# EAGLE design V2 (EAGLE 9.6.2)
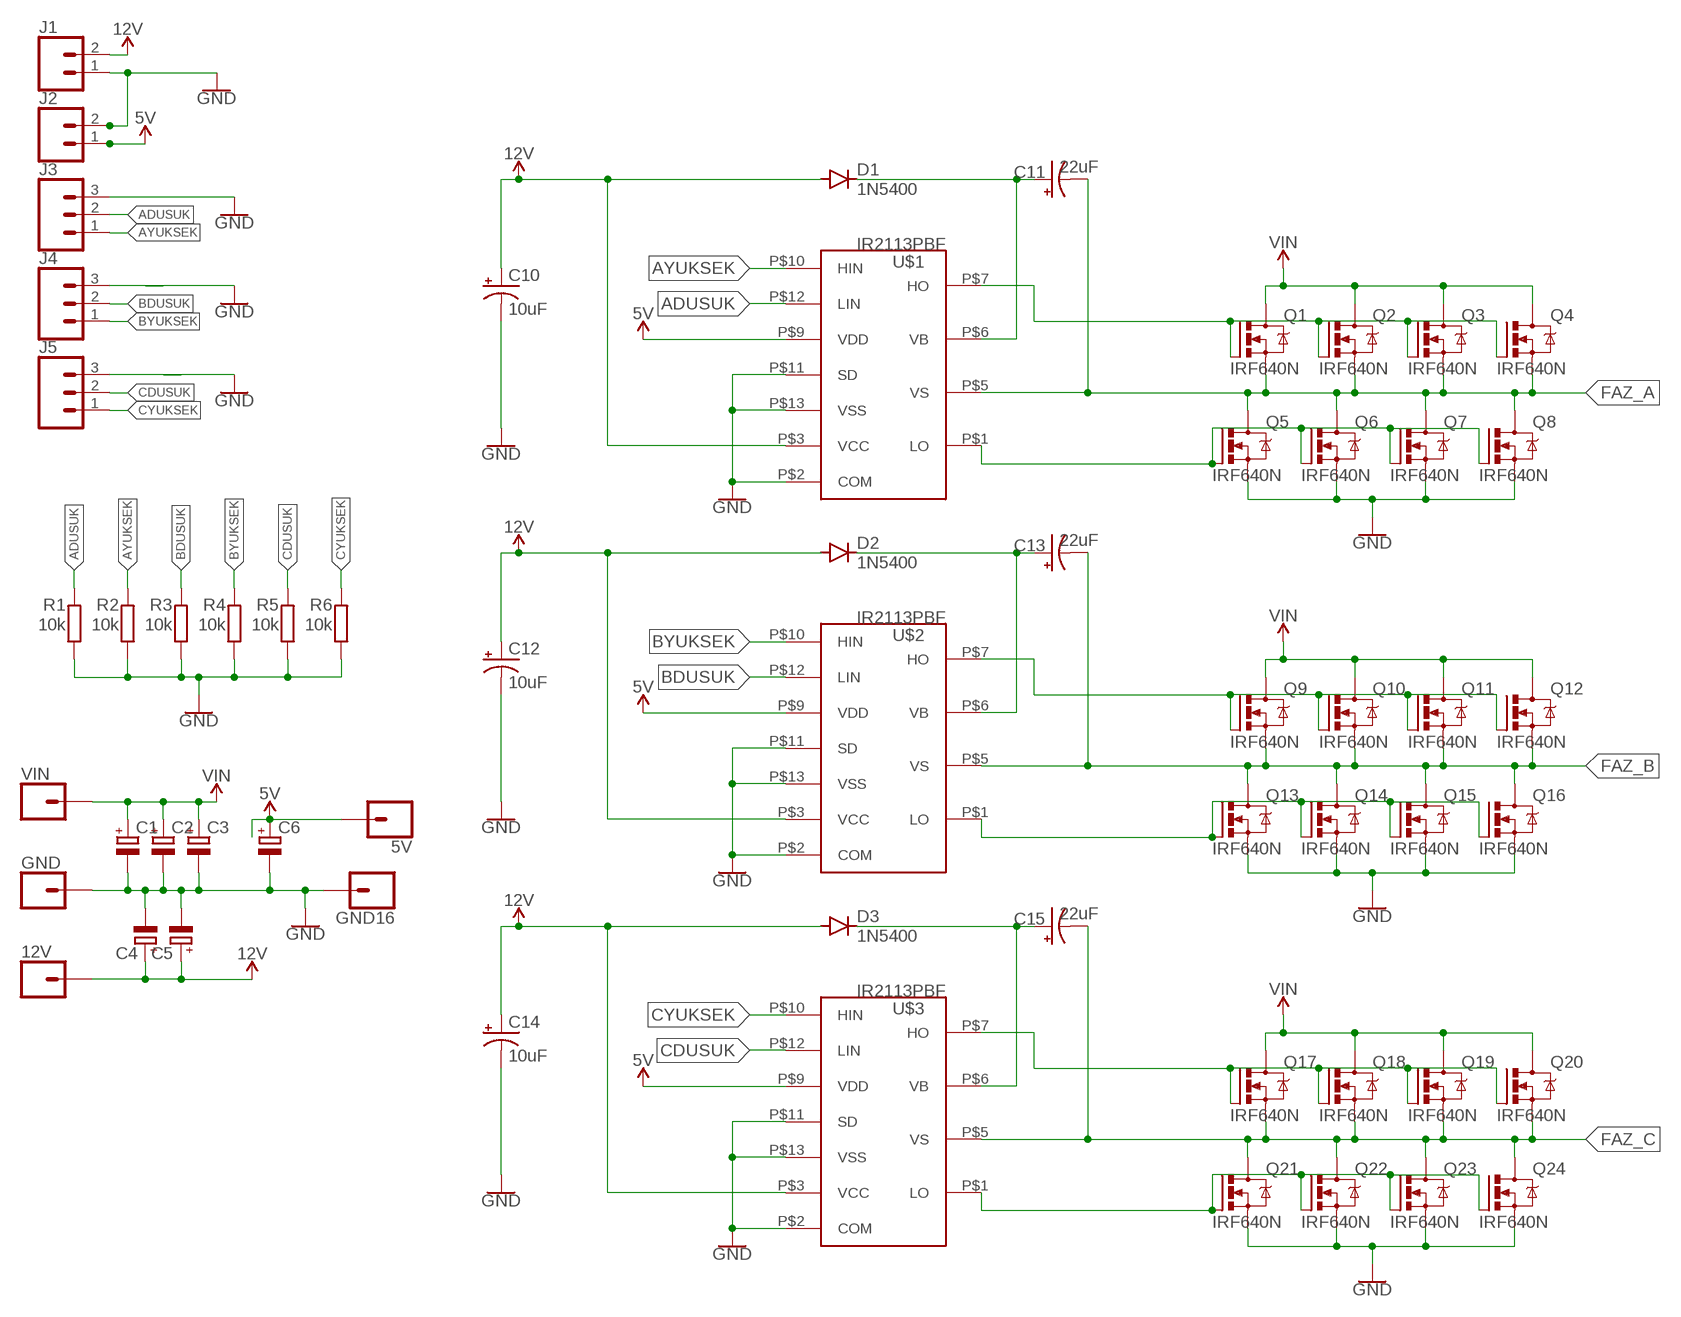
[diagram p0: schematic, sheet 1]

## Parts
5V  CONN_01SNAP-MALE  [SNAP-MALE]
12V  CONN_01SNAP-MALE  [SNAP-MALE]
C1  16MM-DIA-CAPASITOR  [16MM-DIA-CAPASITOR]
C2  16MM-DIA-CAPASITOR  [16MM-DIA-CAPASITOR]
C3  16MM-DIA-CAPASITOR  [16MM-DIA-CAPASITOR]
C4  16MM-DIA-CAPASITOR  [16MM-DIA-CAPASITOR]
C5  16MM-DIA-CAPASITOR  [16MM-DIA-CAPASITOR]
C6  C-POL_RADIAL-25MM-DIA  [CAPPRD550W110D1250H2500B]
C10  10uF  10UF-POLAR-RADIAL-2.5MM-25V-20%  [CPOL-RADIAL-2.5MM-5MM]
C11  22uF  10UF-POLAR-RADIAL-2.5MM-25V-20%  [CPOL-RADIAL-2.5MM-5MM]
C12  10uF  10UF-POLAR-RADIAL-2.5MM-25V-20%  [CPOL-RADIAL-2.5MM-5MM]
C13  22uF  10UF-POLAR-RADIAL-2.5MM-25V-20%  [CPOL-RADIAL-2.5MM-5MM]
C14  10uF  10UF-POLAR-RADIAL-2.5MM-25V-20%  [CPOL-RADIAL-2.5MM-5MM]
C15  22uF  10UF-POLAR-RADIAL-2.5MM-25V-20%  [CPOL-RADIAL-2.5MM-5MM]
D1  1N5400  [DO201-15]
D2  1N5400  [DO201-15]
D3  1N5400  [DO201-15]
GND  CONN_01SNAP-MALE  [SNAP-MALE]
GND16  CONN_01SNAP-MALE  [SNAP-MALE]
J1  CONN_025MM  [SCREWTERMINAL-5MM-2]
J2  CONN_025MM  [SCREWTERMINAL-5MM-2]
J3  CONN_03-SCREW-5MM  [SCREWTERMINAL-5MM-3]
J4  CONN_03-SCREW-5MM  [SCREWTERMINAL-5MM-3]
J5  CONN_03-SCREW-5MM  [SCREWTERMINAL-5MM-3]
Q1  IRF640N  [TO-220-PAD]
Q2  IRF640N  [TO-220-PAD]
Q3  IRF640N  [TO-220-PAD]
Q4  IRF640N  [TO-220-PAD]
Q5  IRF640N  [TO-220-PAD]
Q6  IRF640N  [TO-220-PAD]
Q7  IRF640N  [TO-220-PAD]
Q8  IRF640N  [TO-220-PAD]
Q9  IRF640N  [TO-220-PAD]
Q10  IRF640N  [TO-220-PAD]
Q11  IRF640N  [TO-220-PAD]
Q12  IRF640N  [TO-220-PAD]
Q13  IRF640N  [TO-220-PAD]
Q14  IRF640N  [TO-220-PAD]
Q15  IRF640N  [TO-220-PAD]
Q16  IRF640N  [TO-220-PAD]
Q17  IRF640N  [TO-220-PAD]
Q18  IRF640N  [TO-220-PAD]
Q19  IRF640N  [TO-220-PAD]
Q20  IRF640N  [TO-220-PAD]
Q21  IRF640N  [TO-220-PAD]
Q22  IRF640N  [TO-220-PAD]
Q23  IRF640N  [TO-220-PAD]
Q24  IRF640N  [TO-220-PAD]
R1  10k  R-EU_0207/10  [0207/10]
R2  10k  R-EU_0207/10  [0207/10]
R3  10k  R-EU_0207/10  [0207/10]
R4  10k  R-EU_0207/10  [0207/10]
R5  10k  R-EU_0207/10  [0207/10]
R6  10k  R-EU_0207/10  [0207/10]
U$1  IR2113PBF  [PDIP-14]
U$2  IR2113PBF  [PDIP-14]
U$3  IR2113PBF  [PDIP-14]
VIN  CONN_01SNAP-MALE  [SNAP-MALE]

## Nets
5V: 5V.2 C6.1(+) J2.1 U$1.P$9(VDD) U$2.P$9(VDD) U$3.P$9(VDD)
12V: 12V.2 C4.+ C5.+ C10.1(+) C12.1(+) C14.1(+) D1.A D2.A D3.A J1.2 U$1.P$3(VCC) U$2.P$3(VCC) U$3.P$3(VCC)
ADUSUK: J3.2 R1.2 U$1.P$12(LIN)
AYUKSEK: J3.1 R2.2 U$1.P$10(HIN)
BDUSUK: J4.2 R3.2 U$2.P$12(LIN)
BYUKSEK: J4.1 R4.2 U$2.P$10(HIN)
CDUSUK: J5.2 R5.2 U$3.P$12(LIN)
CYUKSEK: J5.1 R6.2 U$3.P$10(HIN)
FAZ_A: C11.2(-) Q1.3(S) Q2.3(S) Q3.3(S) Q4.3(S) Q5.TAB(D) Q6.TAB(D) Q7.TAB(D) Q8.TAB(D) U$1.P$5(VS)
FAZ_A_H: Q1.1(G) Q2.1(G) Q3.1(G) Q4.1(G) U$1.P$7(HO)
FAZ_A_L: Q5.1(G) Q6.1(G) Q7.1(G) Q8.1(G) U$1.P$1(LO)
FAZ_B: C13.2(-) Q9.3(S) Q10.3(S) Q11.3(S) Q12.3(S) Q13.TAB(D) Q14.TAB(D) Q15.TAB(D) Q16.TAB(D) U$2.P$5(VS)
FAZ_B_H: Q9.1(G) Q10.1(G) Q11.1(G) Q12.1(G) U$2.P$7(HO)
FAZ_B_L: Q13.1(G) Q14.1(G) Q15.1(G) Q16.1(G) U$2.P$1(LO)
FAZ_C: C15.2(-) Q17.3(S) Q18.3(S) Q19.3(S) Q20.3(S) Q21.TAB(D) Q22.TAB(D) Q23.TAB(D) Q24.TAB(D) U$3.P$5(VS)
FAZ_C_H: Q17.1(G) Q18.1(G) Q19.1(G) Q20.1(G) U$3.P$7(HO)
GND: C1.- C2.- C3.- C4.- C5.- C6.2(-) C10.2(-) C12.2(-) C14.2(-) GND16.2 GND.2 J1.1 J2.2 J3.3 J4.3 J5.3 Q5.3(S) Q6.3(S) Q7.3(S) Q8.3(S) Q13.3(S) Q14.3(S) Q15.3(S) Q16.3(S) Q21.3(S) Q22.3(S) Q23.3(S) Q24.3(S) R1.1 R2.1 R3.1 R4.1 R5.1 R6.1 U$1.P$2(COM) U$1.P$11(SD) U$1.P$13(VSS) U$2.P$2(COM) U$2.P$11(SD) U$2.P$13(VSS) U$3.P$2(COM) U$3.P$11(SD) U$3.P$13(VSS)
N$1: C13.1(+) D2.C U$2.P$6(VB)
N$2: C11.1(+) D1.C U$1.P$6(VB)
N$3: C15.1(+) D3.C U$3.P$6(VB)
N$7: Q21.1(G) Q22.1(G) Q23.1(G) Q24.1(G) U$3.P$1(LO)
VIN: C1.+ C2.+ C3.+ Q1.TAB(D) Q2.TAB(D) Q3.TAB(D) Q4.TAB(D) Q9.TAB(D) Q10.TAB(D) Q11.TAB(D) Q12.TAB(D) Q17.TAB(D) Q18.TAB(D) Q19.TAB(D) Q20.TAB(D) VIN.2

## Library data of the parts
5V 12V GND GND16 VIN = SparkFun-Connectors:CONN_01: Single connection point. Often used as Generic Header-pin footprint for 0.1 inch spaced/style header connections On any of the 0.1 inch spaced packages, you can populate with these: Break Away Headers - Straight <https://www.sparkfun.com/products/116> (PRT-00116) Break Away Male Headers - Right Angle <https://www.sparkfun.com/products/553> (PRT-00553) Female Headers <https://www.sparkfun.com/products/115> (PRT-00115) Break Away Headers - Machine Pin <https://www.sparkfun.com/products/117> (PRT-00117) Break Away Female Headers - Swiss Machine Pin <https://www.sparkfun.com/products/743> (PRT-00743) This device is also useful as a general connection point to wire up your design to another part of your project. Our various solder wires solder well into these plated through hole pads. Hook-Up Wire - Assortment (Stranded, 22 AWG) <https://www.sparkfun.com/products/11375> (PRT-11375) Hook-Up Wire - Assortment (Solid Core, 22 AWG) <https://www.sparkfun.com/products/11367> (PRT-11367) View the entire wire category on our website here <https://www.sparkfun.com/categories/141> Special notes: SMTSO-256-ET is a "flush mount" nut for a 4-40 screw. We mostly use this on specialty testbeds; it is a nice way to connect hardware to your PCB at an adjustable hieght. Also note, the SNAP packages are for using a snappable style connector. We sell a baggie of snaps and they are also used on two LilyPad designs: Snap Assortment - 30 pack (male and female) <https://www.sparkfun.com/products/11347> (DEV-11347) LilyPad Arduino SimpleSnap <https://www.sparkfun.com/products/10941> (DEV-10941) LilyPad SimpleSnap Protoboard <https://www.sparkfun.com/products/10940> (DEV-10940)
C1-C5 = El_yapimi:16MM-DIA-CAPASITOR
C6 = Capacitor:C-POL: Capacitor Polarised - Generic; CATEGORY: Capacitor
C10 C12 C14 = SparkFun-Capacitors:10UF-POLAR: 10.0µF polarized capacitors A capacitor is a passive two-terminal electrical component used to store electrical energy temporarily in an electric field.; PROD_ID: CAP-08440
C11 C13 C15 = SparkFun-Capacitors:10UF-POLAR: 10.0µF polarized capacitors A capacitor is a passive two-terminal electrical component used to store electrical energy temporarily in an electric field.; PROD_ID: CAP-08440; VALUE: 10uF
D1-D3 = diode:1N5400: DIODE standard rectifier, 3 A, 50 V (Motorola)
J1 J2 = SparkFun-Connectors:CONN_02: Multi connection point. Often used as Generic Header-pin footprint for 0.1 inch spaced/style header connections On any of the 0.1 inch spaced packages, you can populate with these: Break Away Headers - Straight <https://www.sparkfun.com/products/116> (PRT-00116) Break Away Male Headers - Right Angle <https://www.sparkfun.com/products/553> (PRT-00553) Female Headers <https://www.sparkfun.com/products/115> (PRT-00115) Break Away Headers - Machine Pin <https://www.sparkfun.com/products/117> (PRT-00117) Break Away Female Headers - Swiss Machine Pin <https://www.sparkfun.com/products/743> (PRT-00743) For SCREWTERMINALS and SPRING TERMINALS visit here: Screw Terimnals on SparkFun.com <https://www.sparkfun.com/search/results?term=Screw+Terminals> (5mm/3.5mm/2.54mm spacing) This device is also useful as a general connection point to wire up your design to another part of your project. Our various solder wires solder well into these plated through hole pads. Hook-Up Wire - Assortment (Stranded, 22 AWG) <https://www.sparkfun.com/products/11375> (PRT-11375) Hook-Up Wire - Assortment (Solid Core, 22 AWG) <https://www.sparkfun.com/products/11367> (PRT-11367) View the entire wire category on our website here <https://www.sparkfun.com/categories/141> Special notes: Molex polarized connector foot print use with: PRT-08233 with associated crimp pins and housings. 2.54_SCREWTERM for use with PRT-10571. 3.5mm Screw Terminal footprints for PRT-08084 5mm Screw Terminal footprints for use with PRT-08432; SF_SKU: PRT-08432
J3-J5 = SparkFun-Connectors:CONN_03: Multi connection point. Often used as Generic Header-pin footprint for 0.1 inch spaced/style header connections On any of the 0.1 inch spaced packages, you can populate with these: Break Away Headers - Straight <https://www.sparkfun.com/products/116> (PRT-00116) Break Away Male Headers - Right Angle <https://www.sparkfun.com/products/553> (PRT-00553) Female Headers <https://www.sparkfun.com/products/115> (PRT-00115) Break Away Headers - Machine Pin <https://www.sparkfun.com/products/117> (PRT-00117) Break Away Female Headers - Swiss Machine Pin <https://www.sparkfun.com/products/743> (PRT-00743) Stackable Header - 3 Pin (Female, 0.1") <https://www.sparkfun.com/products/13875> (PRT-13875) For SCREWTERMINALS and SPRING TERMINALS visit here: Screw Terimnals on SparkFun.com <https://www.sparkfun.com/search/results?term=Screw+Terminals> (5mm/3.5mm/2.54mm spacing) This device is also useful as a general connection point to wire up your design to another part of your project. Our various solder wires solder well into these plated through hole pads. Hook-Up Wire - Assortment (Stranded, 22 AWG) <https://www.sparkfun.com/products/11375> (PRT-11375) Hook-Up Wire - Assortment (Solid Core, 22 AWG) <https://www.sparkfun.com/products/11367> (PRT-11367) View the entire wire category on our website here <https://www.sparkfun.com/categories/141> Special notes: Molex polarized connector foot print use with SKU : PRT-08232 with associated crimp pins and housings.; PROD_ID: CONN-10134; SF_SKU: PRT-08433
Q1-Q24 = El_yapimi:IRF640N
R1-R6 = resistor:R-EU_: RESISTOR, European symbol
U$1-U$3 = El_yapimi:IR2113PBF

## Board
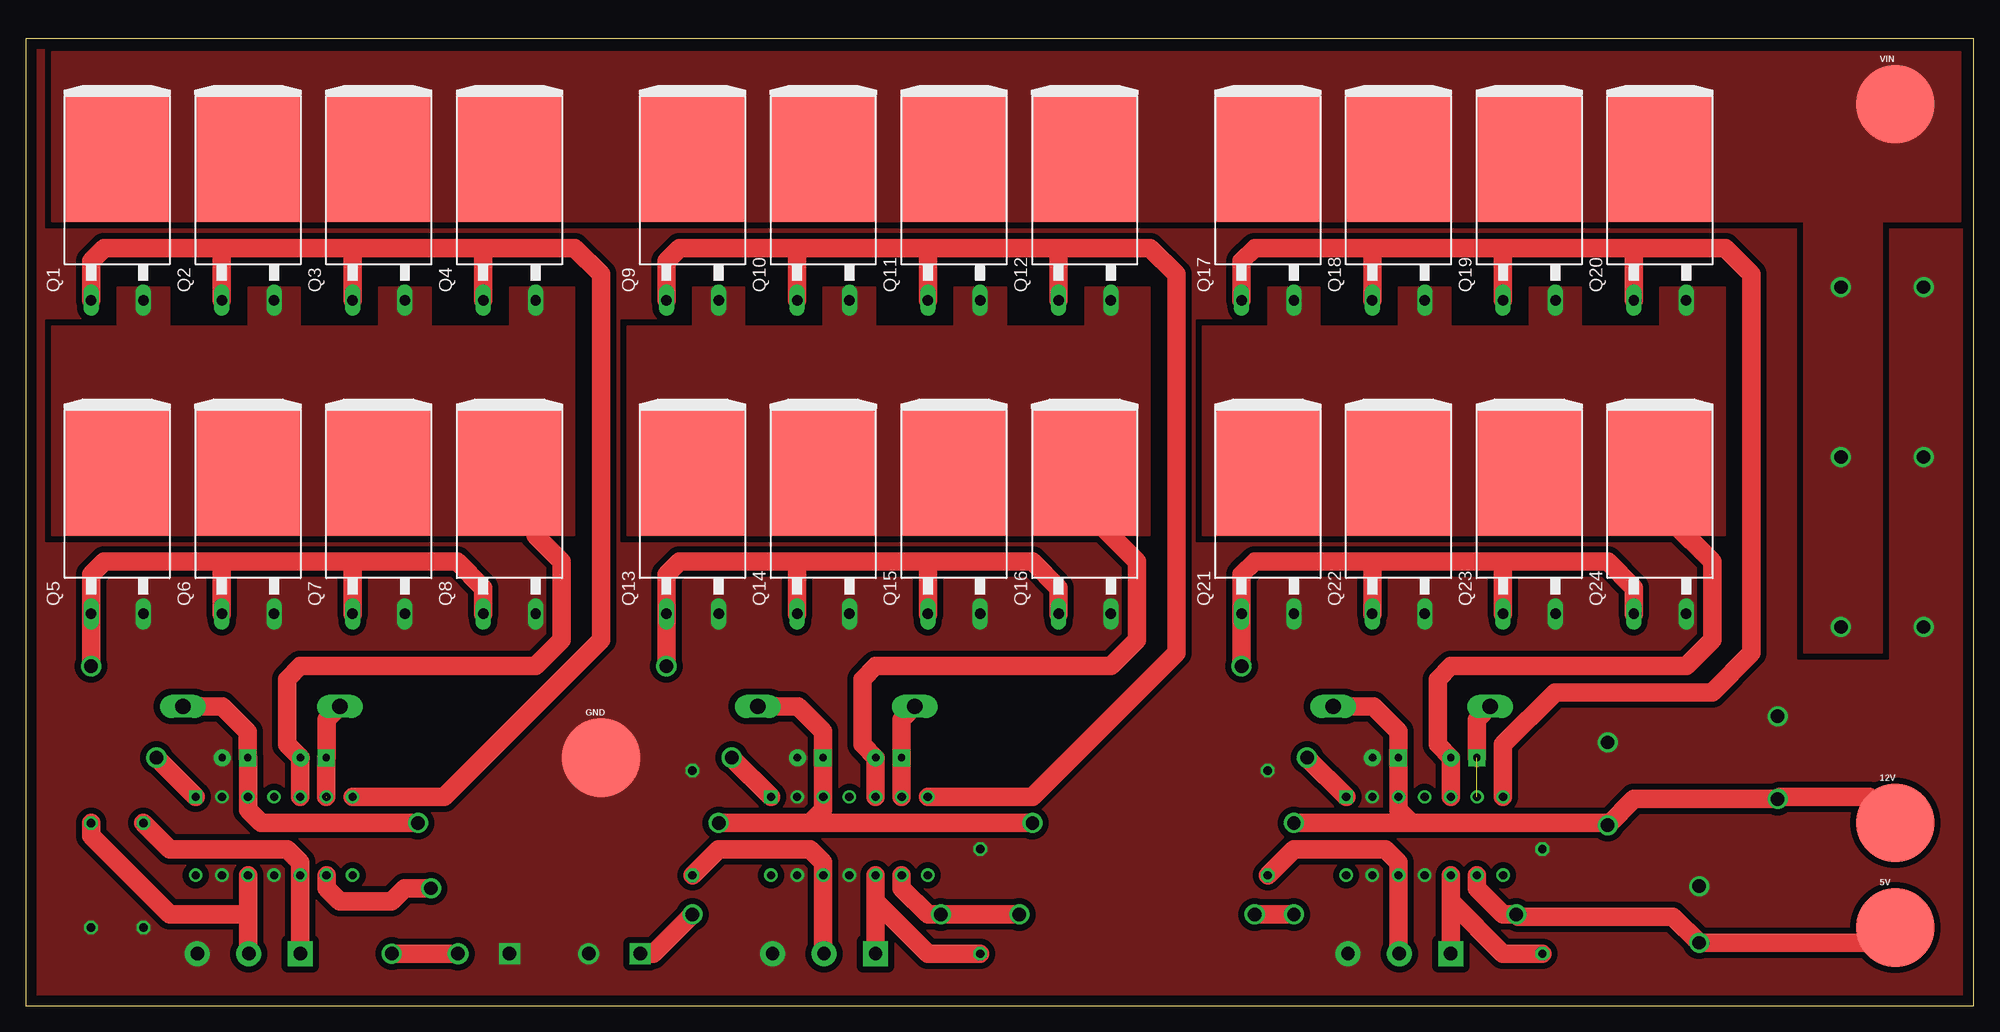
[diagram p1: board, top side]
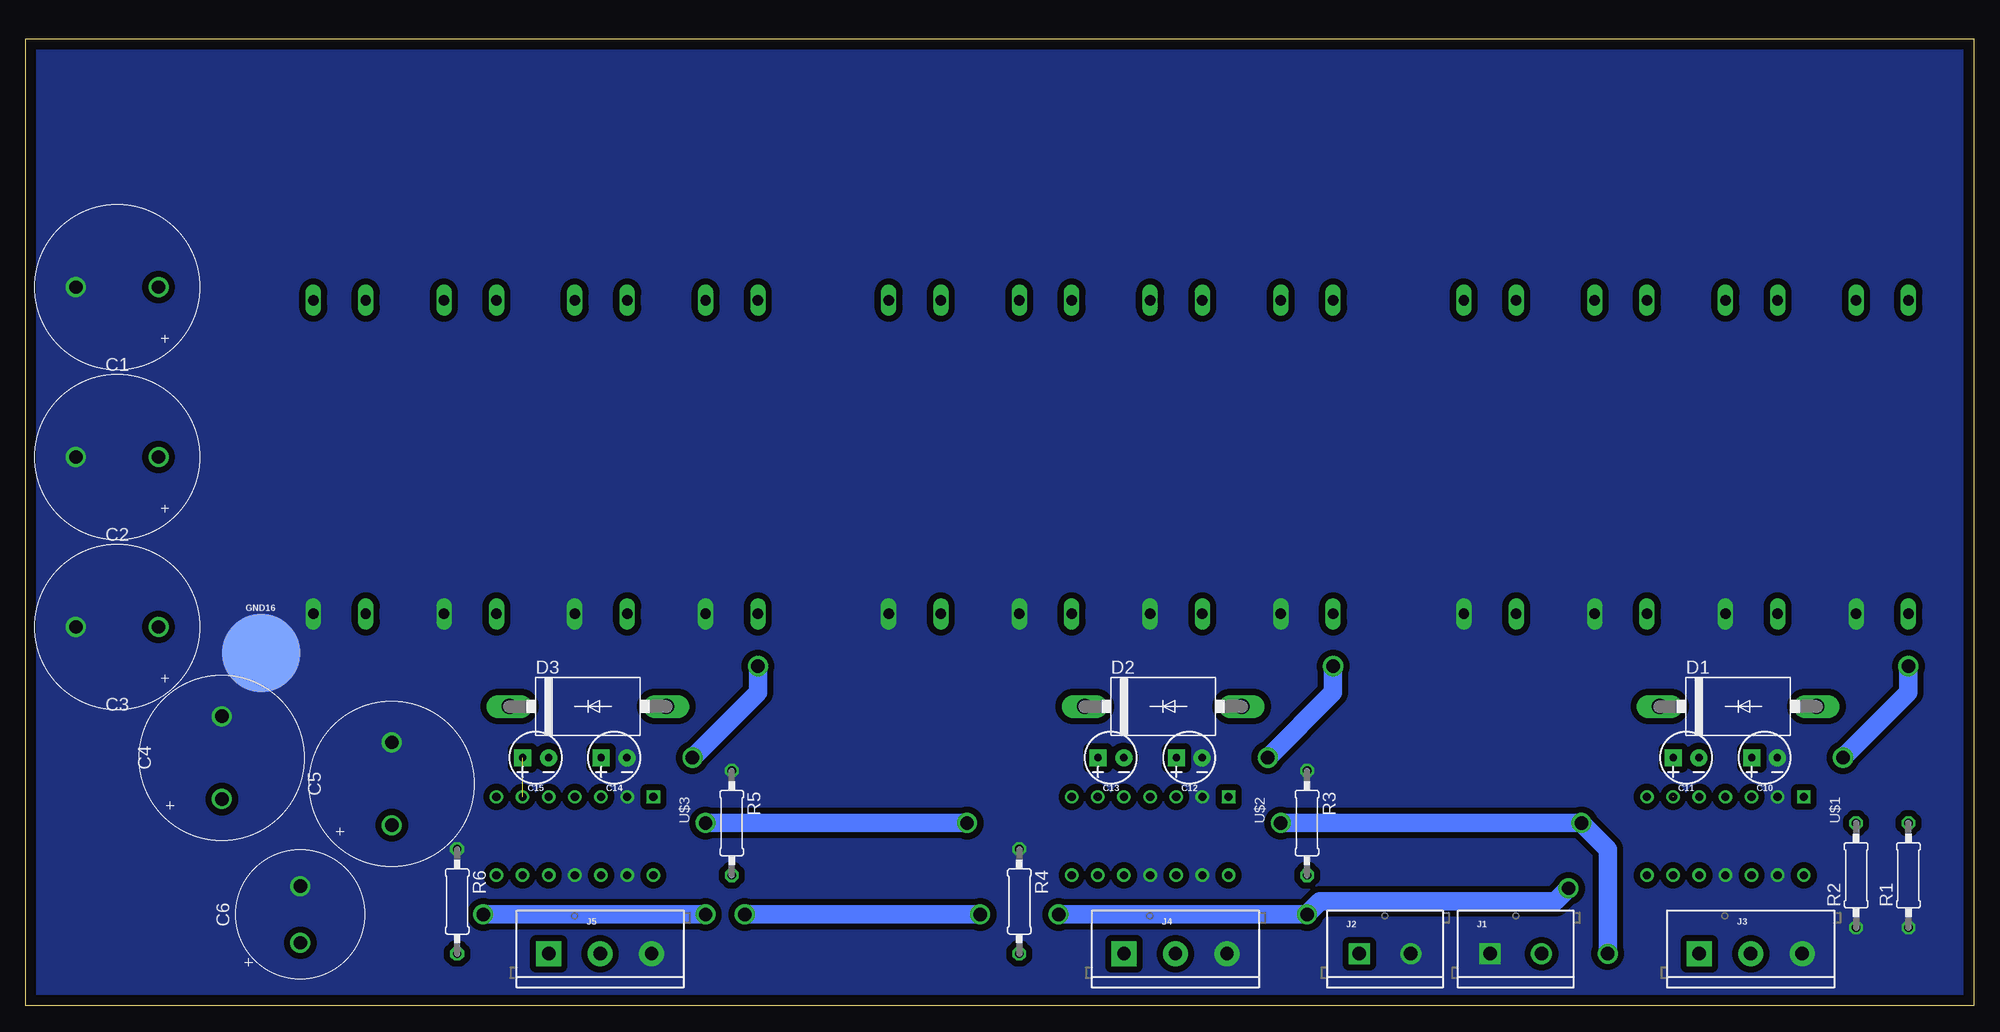
[diagram p2: board, bottom side, seen from below]

Size 189.23 x 93.98 mm. Coordinates in mm from the lower left corner, seen from the top.
Outline: 0,0 189.23,0 189.23,93.98 0,93.98 0,0
Copper layers (1*16): Top 0.035mm / dielectric 1.5mm / Bottom 0.035mm
Design rules "cnc_0.6_eagle_ayarlar": minimum track width 6mil, minimum drill 0.35mm, track to track 0.6mm, track to pad 0.6mm, pad to pad 0.6mm, via to via 0.6mm, smd to smd 0.6mm, copper to edge 40mil, drill to drill 0.6mm, minimum pad ring 10mil, minimum via ring 8mil, stop-mask expansion 4mil, vias tented up to drill 0mil, thermal gap 0.6mm

### Footprints (pad centres in the part's own frame; a part is rotated, then mirrored left to right if it is on the bottom)
SNAP-MALE = smd 7.62 x 7.62: 2 0,0
16MM-DIA-CAPASITOR = drill 1.3 pad 1.95: + -4.02,0; - 4.02,0
CAPPRD550W110D1250H2500B = drill 1.3 pad 1.95: 1 -2.75,0; 2 2.75,0
CPOL-RADIAL-2.5MM-5MM = drill 0.7 pad 1.651 square: 1 1.25,0 | drill 0.7 pad 1.651: 2 -1.25,0
DO201-15 = drill 1.499 long: A 7.62,0; C -7.62,0
SCREWTERMINAL-5MM-2 = drill 1.3 pad 2.032 square: 1 0,0 | drill 1.3 pad 2.032: 2 5,0
SCREWTERMINAL-5MM-3 = drill 1.3 pad 2.413 square: 1 0,0 | drill 1.3 pad 2.413: 2 5,0; 3 10,0
TO-220-PAD = drill 1.016 long: 1 -2.54,-8.89; 3 2.54,-8.89 | smd 10.16 x 12.7: TAB 0,5.08
0207/10 = drill 0.813 octagon: 1 -5.08,0; 2 5.08,0
PDIP-14 = drill 0.8 square: P$1 -3.81,7.62 | drill 0.8: P$2 -3.81,5.08; P$3 -3.81,2.54; P$4 -3.81,0; P$5 -3.81,-2.54; P$6 -3.81,-5.08; P$7 -3.81,-7.62; P$8 3.81,-7.62; P$9 3.81,-5.08; P$10 3.81,-2.54; P$11 3.81,0; P$12 3.81,2.54; P$13 3.81,5.08; P$14 3.81,7.62

### Placement (x,y rotation side)
5V  181.61,7.62 0 top
12V  181.61,17.78 0 top
C1  180.34,69.85 180 bottom
C2  180.34,53.34 180 bottom
C3  180.34,36.83 180 bottom
C4  170.18,24.13 90 bottom
C5  153.67,21.59 90 bottom
C6  162.56,8.89 90 bottom
C10  20.32,24.13 180 bottom
C11  27.94,24.13 180 bottom
C12  76.2,24.13 180 bottom
C13  83.82,24.13 180 bottom
C14  132.08,24.13 180 bottom
C15  139.7,24.13 180 bottom
D1  22.89,29.11 0 bottom
D2  78.74,29.11 0 bottom
D3  134.62,29.11 0 bottom
GND  55.88,24.13 0 top
GND16  166.37,34.29 0 bottom
J1  46.99,5.08 0 bottom
J2  59.69,5.08 0 bottom
J3  26.67,5.08 0 bottom
J4  82.55,5.08 0 bottom
J5  138.43,5.08 0 bottom
Q1  8.89,77.47 0 top
Q2  21.59,77.47 0 top
Q3  34.29,77.47 0 top
Q4  46.99,77.47 0 top
Q5  8.89,46.99 0 top
Q6  21.59,46.99 0 top
Q7  34.29,46.99 0 top
Q8  46.99,46.99 0 top
Q9  64.77,77.47 0 top
Q10  77.47,77.47 0 top
Q11  90.17,77.47 0 top
Q12  102.87,77.47 0 top
Q13  64.77,46.99 0 top
Q14  77.47,46.99 0 top
Q15  90.17,46.99 0 top
Q16  102.87,46.99 0 top
Q17  120.65,77.47 0 top
Q18  133.35,77.47 0 top
Q19  146.05,77.47 0 top
Q20  158.75,77.47 0 top
Q21  120.65,46.99 0 top
Q22  133.35,46.99 0 top
Q23  146.05,46.99 0 top
Q24  158.75,46.99 0 top
R1  6.35,12.7 90 bottom
R2  11.43,12.7 90 bottom
R3  64.77,17.78 270 bottom
R4  92.71,10.16 270 bottom
R5  120.65,17.78 270 bottom
R6  147.32,10.16 270 bottom
U$1  24.13,16.51 270 bottom
U$2  80.01,16.51 270 bottom
U$3  135.89,16.51 270 bottom
VIN  181.61,87.63 0 top

### Tracks (layer width: path | path; a pad name or v marks a point on that pad's centre or on a via)
5V  (via drill 1.3)
  Top 1.778: U$1.P$9 29.21,11.43 30.48,10.16 35.56,10.16 36.83,11.43 v39.37,11.43 | U$2.P$9 85.09,11.43 87.63,8.89 v88.9,8.89 v96.52,8.89 | U$3.P$9 140.97,11.43 143.51,8.89 v144.78,8.89 144.99,8.68 160.02,8.68 C6.1 180.13,6.14 5V.2 | J2.1 60.96,5.08 v64.77,8.89 | v123.19,8.89 v119.38,8.89
  Bottom 1.778: v88.9,8.89 v64.77,8.89 63.5,10.16 40.64,10.16 v39.37,11.43 | v144.78,8.89 v123.19,8.89 | v119.38,8.89 v96.52,8.89
12V  (via drill 1.3)
  Top 1.27: U$2.P$3 77.45,20.34 | U$3.P$3 133.33,20.34
  Top 1.524: C10.1 21.59,24.11
  Top 1.778: 21.59,24.11 U$1.P$3 21.59,19.05 22.86,17.78 v38.1,17.78 | 77.45,20.34 C12.1 77.45,26.67 75.01,29.11 D2.A | 133.33,20.34 C14.1 133.33,26.69 130.91,29.11 D3.A | 134.62,17.78 133.35,19.05 U$3.P$3 | v97.79,17.78 76.2,17.78 | U$2.P$3 77.47,19.05 76.2,17.78 | 134.62,17.78 153.46,17.78 C5.+ 156.21,20.11 C4.+ 170.39,20.32 179.07,20.32 12V.2 | J1.2 v35.56,5.08 | C10.1 21.57,26.61 19.07,29.11 D1.A | v123.19,17.78 134.62,17.78 | 76.2,17.78 v67.31,17.78
  Bottom 1.778: v35.56,5.08 35.56,15.24 v38.1,17.78 v67.31,17.78 | v97.79,17.78 v123.19,17.78
ADUSUK
  Top 1.778: J3.2 21.59,5.16 21.59,8.89 | U$1.P$12 21.59,8.89 | R1.2 6.35,16.51 13.97,8.89 21.59,8.89
AYUKSEK
  Top 1.778: R2.2 13.97,15.24 25.4,15.24 26.67,13.97 U$1.P$10 J3.1
BDUSUK
  Top 1.778: J4.2 77.47,5.16 U$2.P$12 77.47,13.97 76.2,15.24 67.31,15.24 R3.2
BYUKSEK
  Top 1.778: U$2.P$10 82.55,10.08 82.63,10.08 | R4.2 87.63,5.08 82.63,10.08 | J4.1 82.55,10 82.63,10.08
CDUSUK
  Top 1.778: J5.2 133.35,5.16 U$3.P$12 133.35,13.97 132.08,15.24 123.19,15.24 R5.2
CYUKSEK
  Top 1.778: 138.43,10.16 U$3.P$10 | R6.2 143.51,5.08 138.43,10.16 | J5.1 138.43,10.16
FAZ_A
  Top 1.524: C11.2 26.67,24.11
  Top 1.778: 26.67,24.11 U$1.P$5 | C11.2 25.4,25.42 25.4,31.75 26.67,33.02 49.53,33.02 52.07,35.56 52.07,43.18 49.53,45.72 49.53,48.26
  pour Top (no thermals): 8.89,69.85 8.89,66.04 2.54,66.04 2.54,45.72 53.34,45.72 53.34,69.85 46.99,69.85 46.99,66.04 39.37,66.04 39.37,69.85 34.29,69.85 34.29,66.04 26.67,66.04 26.67,69.85 21.59,69.85 21.59,66.04 13.97,66.04 13.97,69.85
FAZ_A_H
  Top 1.778: Q1.1 6.35,72.39 7.62,73.66 19.05,73.66 | U$1.P$7 40.64,20.32 55.88,35.56 55.88,71.12 53.34,73.66 44.45,73.66 | 19.05,73.66 31.75,73.66 | 31.75,73.66 44.45,73.66 | Q2.1 19.05,73.66 | Q3.1 31.75,73.66 | Q4.1 44.45,73.66
FAZ_A_L  (via drill 1.3)
  Top 1.778: 19.05,43.18 7.62,43.18 6.35,41.91 Q5.1 v6.35,33.02 | 19.05,43.18 31.75,43.18 | 31.75,43.18 41.91,43.18 44.45,40.64 Q8.1 | Q7.1 31.75,43.18 | Q6.1 19.05,43.18 | U$1.P$1 v12.7,24.13
  Bottom 1.778: v12.7,24.13 6.35,30.48 v6.35,33.02
FAZ_B
  Top 1.27: 82.57,20.34 U$2.P$5
  Top 1.778: 82.57,20.34 C13.2 81.28,25.42 81.28,31.75 82.55,33.02 105.41,33.02 107.95,35.56 107.95,43.18 104.14,46.99
  pour Top (no thermals): 64.77,69.85 64.77,66.04 58.42,66.04 58.42,45.72 109.22,45.72 109.22,69.85 102.87,69.85 102.87,66.04 95.25,66.04 95.25,69.85 90.17,69.85 90.17,66.04 82.55,66.04 82.55,69.85 77.47,69.85 77.47,66.04 69.85,66.04 69.85,69.85
FAZ_B_H
  Top 1.778: Q9.1 62.23,72.39 63.5,73.66 74.93,73.66 | 74.93,73.66 87.63,73.66 | 87.63,73.66 100.33,73.66 | 100.33,73.66 109.22,73.66 111.76,71.12 111.76,34.29 97.79,20.32 U$2.P$7 | Q11.1 87.63,73.66 | Q10.1 74.93,73.66 | Q12.1 100.33,73.66
FAZ_B_L  (via drill 1.3)
  Top 1.778: 74.93,43.18 63.5,43.18 62.23,41.91 Q13.1 v62.23,33.02 | 74.93,43.18 87.63,43.18 | 87.63,43.18 97.79,43.18 100.33,40.64 Q16.1 | Q15.1 87.63,43.18 | Q14.1 74.93,43.18 | U$2.P$1 v68.58,24.13
  Bottom 1.778: v68.58,24.13 62.23,30.48 v62.23,33.02
FAZ_C
  Top 1.27: 138.43,24.11 C15.2
  Top 1.778: U$3.P$5 138.43,24.11 | C15.2 137.16,25.42 137.16,31.75 138.43,33.02 161.29,33.02 163.83,35.56 163.83,43.18 160.02,46.99
  pour Top (no thermals): 120.65,69.85 120.65,66.04 114.3,66.04 114.3,45.72 165.1,45.72 165.1,69.85 158.75,69.85 158.75,66.04 151.13,66.04 151.13,69.85 146.05,69.85 146.05,66.04 138.43,66.04 138.43,69.85 133.35,69.85 133.35,66.04 125.73,66.04 125.73,69.85
FAZ_C_H
  Top 1.778: Q17.1 118.11,72.39 119.38,73.66 130.81,73.66 | 130.81,73.66 143.51,73.66 | 143.51,73.66 156.21,73.66 | 156.21,73.66 165.1,73.66 167.64,71.12 167.64,34.29 163.83,30.48 148.59,30.48 143.51,25.4 U$3.P$7 | Q18.1 130.81,73.66 | Q19.1 143.51,73.66 | Q20.1 156.21,73.66
GND
  pour Top (rank 3, no thermals): -1.27,95.25 -1.27,-1.27 190.5,-1.27 190.5,95.25
  pour Bottom (no thermals): -2.54,96.52 -2.54,-2.54 191.77,-2.54 191.77,96.52
N$1  (1 unrouted)
  Top 1.27: C13.1 85.09,24.15
  Top 1.778: 85.07,20.34 C13.1 85.07,27.82 D2.C
N$2  (1 unrouted)
  Top 1.524: C11.1 29.21,24.15
  Top 1.778: 29.19,20.34 C11.1 29.23,24.18 29.23,27.84 D1.C
N$3  (1 unrouted)
  Top 1.27: 140.97,24.15 C15.1 140.97,24.11
  Top 1.778: C15.1 140.95,27.82 D3.C
N$7  (via drill 1.3)
  Top 1.778: Q24.1 156.21,40.64 153.67,43.18 143.51,43.18 | 130.81,43.18 119.38,43.18 118.11,41.91 Q21.1 v118.11,33.02 | 130.81,43.18 143.51,43.18 | Q23.1 143.51,43.18 | Q22.1 130.81,43.18 | U$3.P$1 v124.46,24.13
  Bottom 1.778: v124.46,24.13 118.11,30.48 v118.11,33.02
VIN
  pour Top (no thermals): 2.54,92.71 2.54,76.2 172.72,76.2 172.72,34.29 180.34,34.29 180.34,76.2 187.96,76.2 187.96,92.71